# Altium project PCB_Project1.PrjPCB
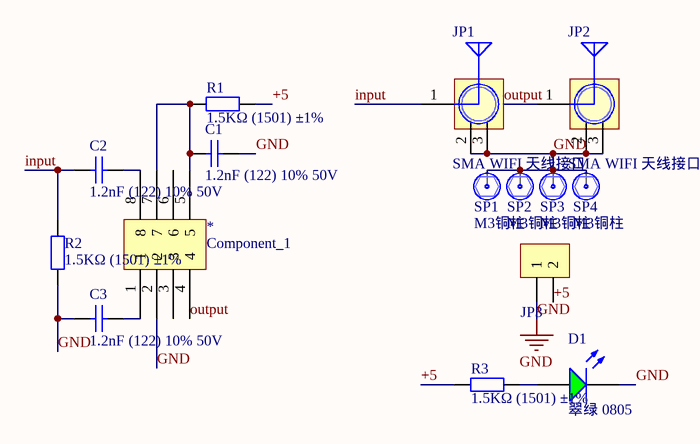
[diagram p0: AD8310峰值检测.SchDoc]
1 sheet, 15 parts. Net scope: global (net labels, ports and power ports of the same name join across sheets).
Board file: AD8310峰值检测.PcbDoc

## Sheet AD8310峰值检测.SchDoc
size A4

### Parts
*  Component_1  [MSOP8_N]
C1  1.2nF (122) 10% 50V  [0603_C]
C2  1.2nF (122) 10% 50V  [0603_C]
C3  1.2nF (122) 10% 50V  [0603_C]
D1  翠绿 0805  [0805_LED_S1]
JP1  SMA WIFI 天线接口  [SMA-KE]
JP2  SMA WIFI 天线接口  [SMA-KE]
JP3  HDR-1X2  [XH2.54-LI-2P]  (value not drawn)
R1  1.5KΩ (1501) ±1%  [0603_R]
R2  1.5KΩ (1501) ±1%  [0603_R]
R3  1.5KΩ (1501) ±1%  [0603_R]
SP1  M3铜柱  [M3x4_L]
SP2  M3铜柱  [M3x4_L]
SP3  M3铜柱  [M3x4_L]
SP4  M3铜柱  [M3x4_L]

### Nets
GND: *.2 C1.2 C3.1 D1.K JP1.2(GND) JP1.3(GND) JP2.2(GND) JP2.3(GND) JP3.1 R2.1 SP1.1 SP2.1 SP3.1 SP4.1
+5: JP3.2 R1.2 R3.1
input: C2.1 JP1.1(ANT) R2.2
output: *.4 JP2.1(ANT)
Net*_1: *.1 C3.2
Net*_5: *.5 *.7 C1.1 R1.1
Net*_8: *.8 C2.2
NetD1_A: D1.A R3.2

Not connected (* = marked no-connect by the designer): * 3 6

### Library data of the parts
C1-C3 = 0603 1.2nF (122) 10% 50V: 贴片电容; ComponentLink1Description: 供应商链接; ComponentLink1URL: http://www.szlcsc.com/product/details_31372.html; Package: 0603; Supplier: LC; SuppliersPartNumber: C30615
D1 = 0805 翠绿: 发光二极管; ComponentLink1Description: 供应商链接; ComponentLink1URL: http://www.szlcsc.com/product/details_2670.html; Package: 0805; Supplier: LC; SuppliersPartNumber: C2297
JP1 JP2 = SMA: SMA-2.4G射频天线接口; BOM名称: SMA-2.4G射频天线接口
JP3 = Header 2: 2P接插件; BOM名称: 2P接插件
R1-R3 = 0603 1.5KΩ (1501) 1%: 贴片电阻; ComponentLink1Description: 供应商链接; ComponentLink1URL: http://www.szlcsc.com/product/details_23570.html; Package: 0603; Supplier: LC; SuppliersPartNumber: C22843
SP1-SP4 = 铜柱小焊盘: 铜柱; BOM名称: 铜柱